# Altium schematic sheet GNSS.SchDoc: MoonPilot - GNSS
size A3; DrawnBy: Máni Magnússon; Revision: A; SheetNumber: 3
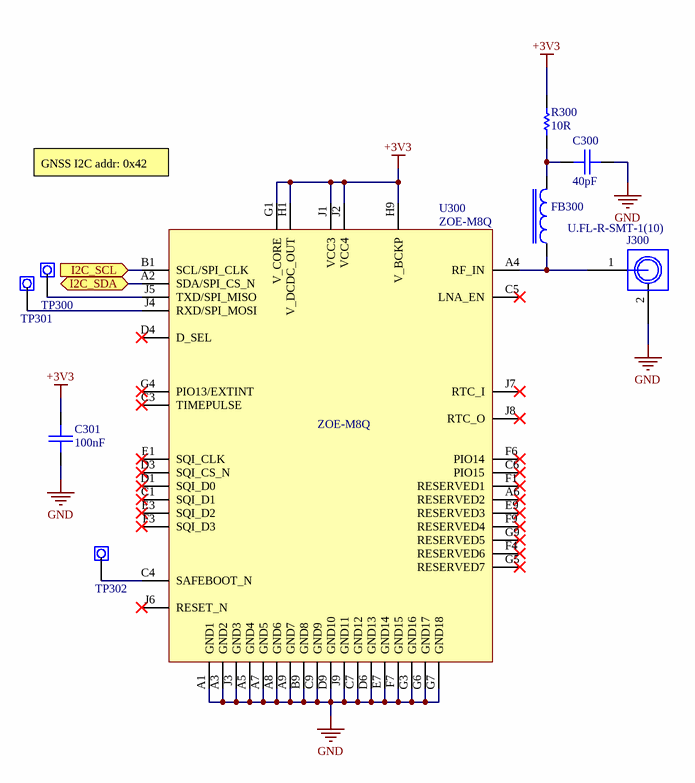
[diagram p0: GNSS.SchDoc]

## Parts
C300  40pF  [0603_CAP]
C301  100nF  [0603_CAP]
FB300  FBTH1608HL221-T  [0603_FERRITE]  (value not drawn)
J300  U.FL-R-SMT-1(10)  [U.FL-R-SMT-1(10)]
R300  10R  [0603_RES]
TP300  GPS_TX  [Testpoint]  (value not drawn)
TP301  GPS_RX  [Testpoint]  (value not drawn)
TP302  GPS_SAFEBOOT  [Testpoint2]  (value not drawn)
U300  ZOE-M8Q  [ZOE-M8Q]

## Ports
I2C_SCL (in), I2C_SDA (bidir)

## Nets
+3V3: C301.1 R300.1 U300.G1(V_CORE) U300.H1(V_DCDC_OUT) U300.H9(V_BCKP) U300.J1(VCC3) U300.J2(VCC4)
GND: C300.2 C301.2 J300.2(GND) U300.A1(GND1) U300.A3(GND2) U300.A5(GND4) U300.A7(GND5) U300.A8(GND6) U300.A9(GND7) U300.B9(GND8) U300.C7(GND12) U300.C9(GND9) U300.D6(GND13) U300.D9(GND10) U300.E7(GND14) U300.F7(GND15) U300.G3(GND16) U300.G6(GND17) U300.G7(GND18) U300.J3(GND3) U300.J9(GND11)
I2C_SCL: U300.B1(SCL/SPI_CLK) ; port I2C_SCL
I2C_SDA: U300.A2(SDA/SPI_CS_N) ; port I2C_SDA
NetC300_1: C300.1 FB300.2 R300.2
NetFB300_1: FB300.1 J300.1(SIG) U300.A4(RF_IN)
NetTP300_1: TP300.1 U300.J5(TXD/SPI_MISO)
NetTP301_1: TP301.1 U300.J4(RXD/SPI_MOSI)
NetTP302_1: TP302.1 U300.C4(SAFEBOOT_N)

Not connected (* = marked no-connect by the designer): U300 A6(RESERVED2)* C1(SQI_D1)* C3(TIMEPULSE)* C5(LNA_EN)* C6(PIO15)* D1(SQI_D0)* D3(SQI_CS_N)* D4(D_SEL)* E1(SQI_CLK)* E3(SQI_D2)* E9(RESERVED3)* F1(RESERVED1)* F3(SQI_D3)* F4(RESERVED6)* F6(PIO14)* F9(RESERVED4)* G4(PIO13/EXTINT)* G5(RESERVED7)* G9(RESERVED5)* J6(RESET_N)* J7(RTC_I)* J8(RTC_O)*

## Notes on the sheet
- GNSS I2C addr: 0x42
- Sheet title:
- Revision:
- Drawn by:
- Date:
- File:

## Library data of the parts
C300 C301 = Capacitor
FB300 = Ferrite Bead: Digikey part no. / 587-FBTH1608HL221-TCT-ND
J300 = U.FL SMD: Digikey part no. H11891CT-ND
R300 = Resistor
TP300-TP302 = Testpoint
U300 = ZOE-M8Q: u-blox ZOE GNSS module; Part Description: u-blox ZOE-M8Q GNSS module; Manufacturer: u-blox; Value: ZOE-M8Q